# Altium schematic sheet wisp-5-afe.SchDoc
size Letter
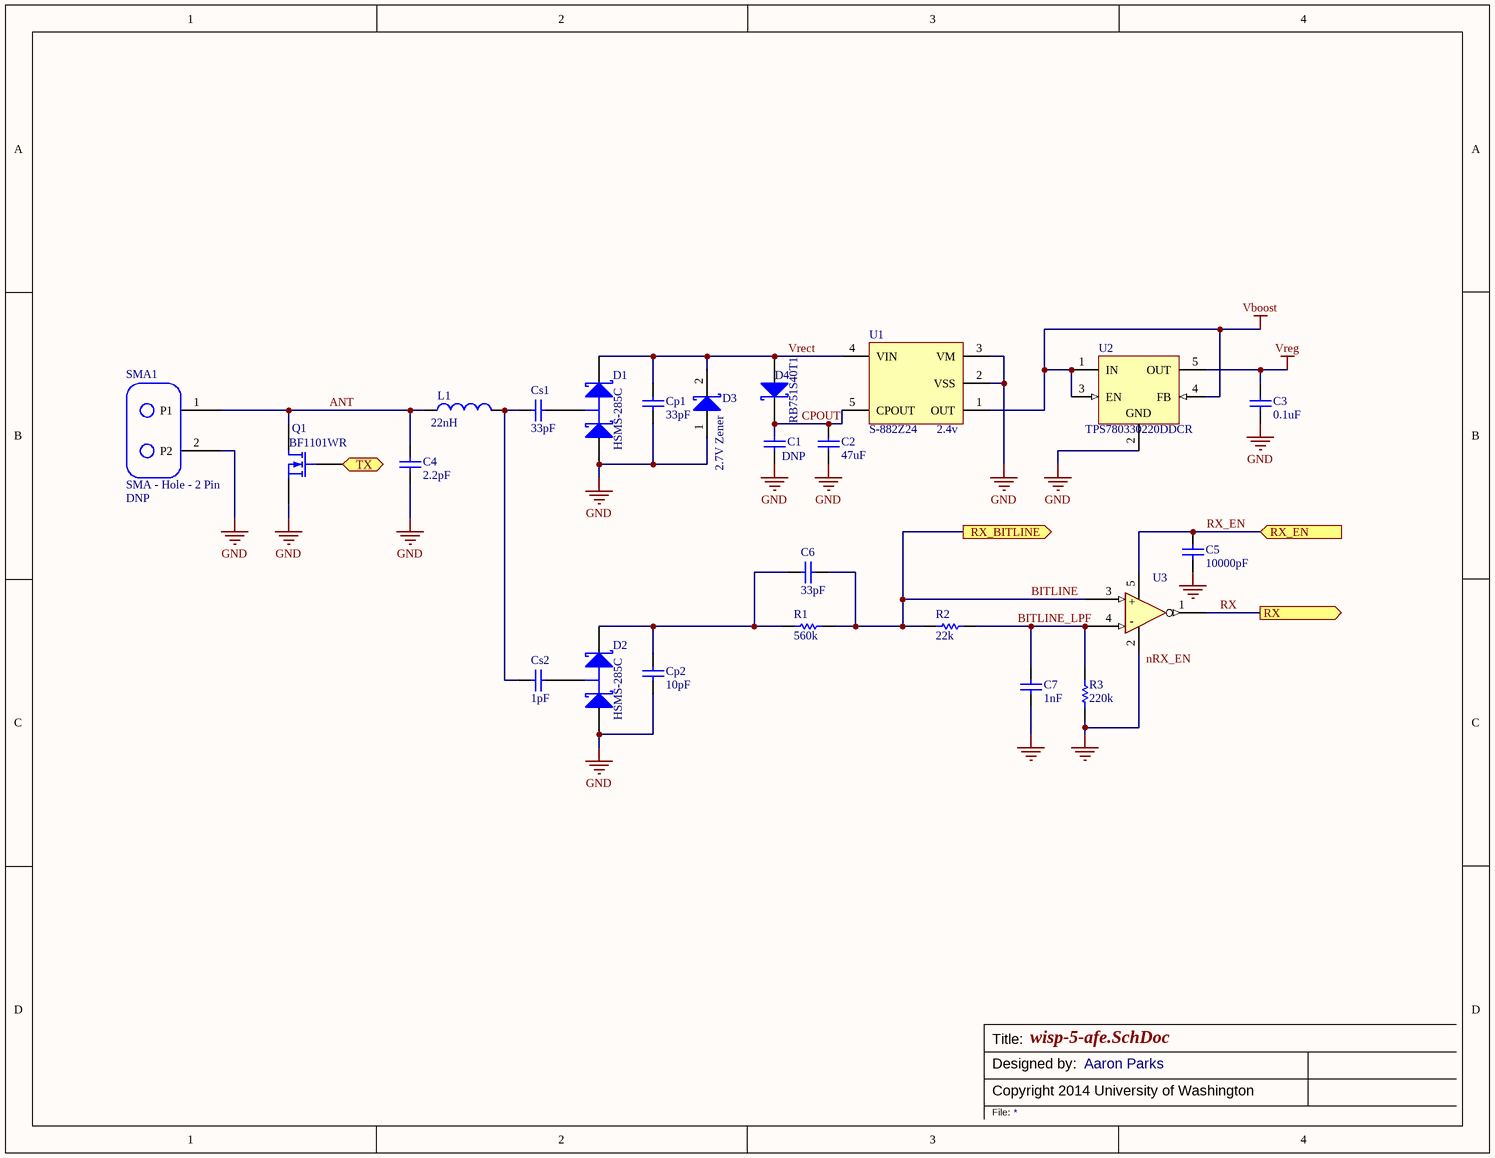
[diagram p0: wisp-5-afe.SchDoc]

## Parts
C1  Cap  [0805]  (value not drawn)
C2  value 47uF  [0805]  (hidden comment: Cap)
C3  value 0.1uF  [0402]  (hidden comment: Cap)
C4  value 2.2pF  [0402]  (hidden comment: Cap)
C5  value 10000pF  [0402]  (hidden comment: Cap)
C6  value 33pF  [0402]  (hidden comment: Cap)
C7  value 1nF  [0402]  (hidden comment: Cap)
Cp1  value 33pF  [0402]  (hidden comment: Cap)
Cp2  value 10pF  [0402]  (hidden comment: Cap)
Cs1  value 33pF  [0402]  (hidden comment: Cap)
Cs2  value 1pF  [0402]  (hidden comment: Cap)
D1  HSMS-285C  [SOT-323, HSMS-285C]
D2  HSMS-285C  [SOT-323, HSMS-285C]
D3  2.7V Zener  [DIOD-SOD-123-2_V]
D4  RB751S40T1  [SOD-523]
L1  value 22nH  [0603]  (hidden comment: Ind)
Q1  BF1101WR  [SOT343R]
R1  value 560k  [0402]  (hidden comment: Res)
R2  value 22k  [0402]  (hidden comment: Res)
R3  value 220k  [0402]  (hidden comment: Res)
SMA1  SMA - Hole - 2 Pin  [SMA - Hole - 2 Pin]
U1  S-882Z24  value 2.4v  [SOT23-5]
U2  TPS780330220DDCR  [TI-DDC5_L]
U3  Comparator  [SC70-5]  (value not drawn)

## Ports
RX (out), RX_BITLINE (out), RX_EN (in), TX (in)

## Nets
GND: C1.2 C2.2 C3.1 C4.1 C5.2 C7.2 Cp1.2 Cp2.2 D1.1(A) D2.1(A) D3.1(A) Q1.1(S) R3.2 SMA1.2(P2) U1.2(VSS) U1.3(VM) U2.2(GND) U3.2(Gnd)
Vboost: U1.1(OUT) U2.1(IN) U2.3(EN) U2.4(FB)
Vreg: C3.2 U2.5(OUT)
ANT: C4.2 L1.1 Q1.2(D) SMA1.1(P1)
BITLINE: C6.2 R1.1 R2.2 U3.3(IN+) ; port RX_BITLINE
BITLINE_LPF: C7.1 R2.1 R3.1 U3.4(In-)
CPOUT: C1.1 C2.1 D4.1(C) U1.5(CPOUT)
RX: U3.1(OUT) ; port RX
RX_EN: C5.1 U3.5(VDD) ; port RX_EN
TX: Q1.3(G) ; port TX
Vrect: Cp1.1 D1.2(K) D3.2(K) D4.2(A) U1.4(VIN)
NetC6_1: C6.1 Cp2.1 D2.2(K) R1.2
NetCs1_1: Cs1.1 Cs2.1 L1.2
NetCs1_2: Cs1.2 D1.3(C)
NetCs2_2: Cs2.2 D2.3(C)

## Notes on the sheet
- Title:
- Copyright 2014 University of Washington
- Designed by:
- Aaron Parks
- File:
- Labels drawn without touching a wire or pin: nRX_EN
- (in symbol NCS2200) +; -

## Library data of the parts
C1 = Cap: Ceramic Capacitor (Surface Mount); Value: DNP; Digi-Key Part Number: *; Manufacturer Part Number: *; Note: *; Rating: *; DNP: DNP
C2 = Cap: Ceramic Capacitor (Surface Mount); Manufacturer: Samsung Electro-Mechanics; Manufacturer Part Number: CL21A476MQCLRNC; Rating: 6.3V; Digi-Key Part Number: 1276-2420-1-ND; Note: *
C3 = Cap: Ceramic Capacitor (Surface Mount); Manufacturer: Murata; Manufacturer Part Number: GRM155R71C104KA88D; Digi-Key Part Number: 490-3261-1-ND; Note: *; Rating: *
C4 = Cap: Ceramic Capacitor (Surface Mount); Manufacturer: Johanson; Manufacturer Part Number: 500R07S5R6CV4T; Digi-Key Part Number: 712-1289-1-ND; Note: *; Rating: *
C5 = Cap: Ceramic Capacitor (Surface Mount); Manufacturer: Generic Ceramic Chip Cap (TBD); Manufacturer Part Number: CL05B103KP5NNNC; Digi-Key Part Number: 1276-1502-1-ND; Note: *; Rating: *
C6 Cp1 Cs1 = Cap: Ceramic Capacitor (Surface Mount); Manufacturer: Johanson; Manufacturer Part Number: 500R07S330JV4T; Digi-Key Part Number: 712-1298-1-ND; Note: *; Rating: *
C7 = Cap: Ceramic Capacitor (Surface Mount); Manufacturer: Generic Ceramic Chip Cap (TBD); Manufacturer Part Number: GRM1555C1H102JA01D; Digi-Key Part Number: 490-3244-1-ND; Note: *; Rating: *
Cp2 = Cap: Ceramic Capacitor (Surface Mount); Manufacturer: Johanson; Manufacturer Part Number: 500R07S100JV4T; Digi-Key Part Number: 712-1253-1-ND; Note: *; Rating: *
Cs2 = Cap: Ceramic Capacitor (Surface Mount); Manufacturer: Johanson; Manufacturer Part Number: 500R07S1R0BV4T; Digi-Key Part Number: 712-1266-1-ND; Note: *; Rating: *
D1 D2 = HSMS-285C: Agilent Schottky Diode, Two in Series, Small Package SOT-323; Manufacturer: Avago Technologies US Inc.; Manufacturer Part Number: HSMS-285C-BLKG; Note: *; Digi-Key Part Number: 516-2558-ND; Rating: *; Value: *
D3 = CMP-0303-00003-1: 1.0 A Surface Mount Schottky Barrier Rectifier, 40 V, -65 to 125 degC, 2-Pin SOD-123 Package, RoHS, Tape and Reel; Manufacturer Part Number: MMSZ4682T1G; Manufacturer: ON Semiconductor; Note: This component's footprint matches the one we needed. The PartNumber is for the right component.; PackageDescription: 2-Pin SOD-123, Body 2.7 x 1.55 mm, Pitch 3.7 mm; PackageReference: SOD-123-2; Digi-Key Part Number: MMSZ4682T1GOSCT-ND
D4 = RB751S40T1: Schottky Diode; Manufacturer Part Number: RB751S40T1G; Manufacturer: ON Semiconductor; Note: *; Digi-Key Part Number: RB751S40T1GOSCT-ND
L1 = Ind: Inductor (Surface Mount); Manufacturer: Coilcraft (http://www.coilcraft.com/0402cs.cfm); Manufacturer Part Number: 0402CS-16NX_LU; Digi-Key Part Number: N/A; Rating: *; Note: *
Q1 = BF1101WR: N-Channel Dual-Gate Mos-Fets MOSFET, SOT343R; Manufacturer Part Number: BF1101WR,115; Manufacturer: NXP Semiconductors; Digi-Key Part Number: 568-6140-1-ND; Rating: *; Value: *; Note: *
R1 = Res: Chip Resistor (Surface Mount); Manufacturer: Panasonic; Manufacturer Part Number: ERJ-2RKF5603X; Digi-Key Part Number: P560KLCT-ND; Rating: *; Note: *
R2 = Res: Chip Resistor (Surface Mount); Manufacturer: Panasonic; Manufacturer Part Number: ERJ-2RKF2202X; Digi-Key Part Number: P22.0KLCT-ND; Rating: *; Note: *
R3 = Res: Chip Resistor (Surface Mount); Manufacturer: Panasonic; Manufacturer Part Number: ERJ-2RKF2203X; Digi-Key Part Number: P220KLCT-ND; Rating: *; Note: *
SMA1 = SMA - Hole - 2 Pin: Two pin SMA connector wisp; Note: This part is used to attach the antennae to WISP in the layout; DNP: DNP
U1 = S-882Zxx: ULTRA-LOW VOLTAGE OPERATION CHARGE PUMP IC  FOR STEP-UP DC-DC CONVERTER STARTUP; Manufacturer: Seiko Instruments; Manufacturer Part Number: S-882Z24-M5T1G; Digi-Key Part Number: S-882Z24-M5T1G-ND; Rating: *; Note: *
U2 = CMP-0394-01119-1: Single Output LDO, 150 mA, Adjustable 1.22 to 5.25 V Output, 2.2 to 5.5 V Input, with 500 nA Quiescent Current, 5-pin SOT (DDC), -40 to 125 degC, Green (RoHS & no Sb/Br); Manufacturer: Texas Instruments; PackageReference: DDC5; Manufacturer Part Number: TPS780330220DDCR; PackageVersion: 4204403-2/E; Note: *; Digi-Key Part Number: 296-23332-1-ND
U3 = NCS2200: Comparator: On Semi 10uA Comparator; Manufacturer: ON Semiconductor; Manufacturer Part Number: NCS2200SQ2T2G; Digi-Key Part Number: NCS2200SQ2T2GOSCT-ND; Rating: *; Value: *; Note: *